# Altium schematic sheet PL_IO.SchDoc
size A3
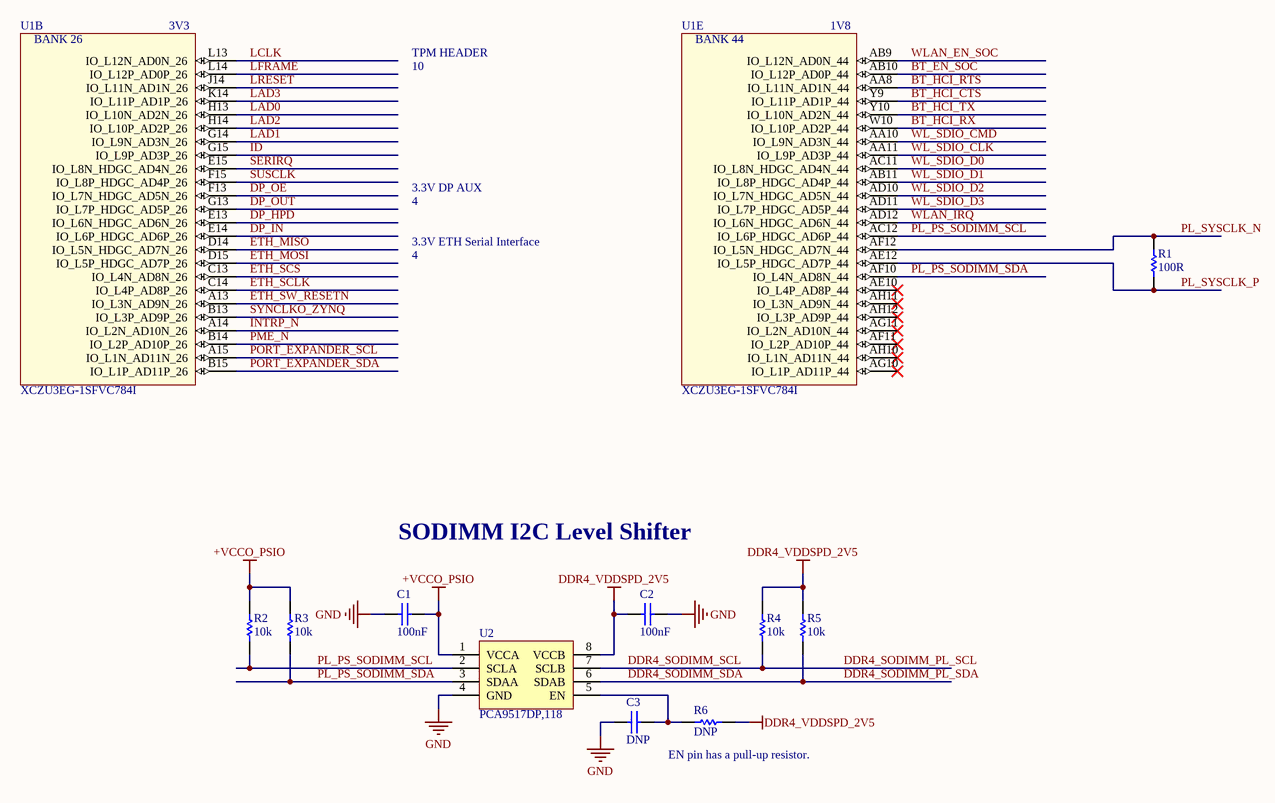
[diagram p0: PL_IO.SchDoc]

## Parts
C1  100nF  [CAPC1005L_0402]
C2  100nF  [CAPC1005L_0402]
C3  DNP  [CAPC1005L_0402]
R1  value 100R  [RESC1005L_0402]  (hidden comment: RES0402_100R_0W1_1T)
R2  value 10k  [RESC1005L_0402]  (hidden comment: RES0402_10K_0W1_05T)
R3  value 10k  [RESC1005L_0402]  (hidden comment: RES0402_10K_0W1_05T)
R4  value 10k  [RESC1005L_0402]  (hidden comment: RES0402_10K_0W1_05T)
R5  value 10k  [RESC1005L_0402]  (hidden comment: RES0402_10K_0W1_05T)
R6  value DNP  [RESC1005L_0402]  (hidden comment: RES0402)
U1  XCZU3EG-1SFVC784I  [BGA784x28]  (parts B,E of 22)
U2  PCA9517DP,118  [MSOP8_PCA9517DP,118]

## Nets
+VCCO_PSIO: C1.2 R2.2 R3.2 U2.1(VCCA)
DDR4_VDDSPD_2V5: C2.1 R4.2 R5.2 R6.2 U2.8(VCCB)
GND: C1.1 C2.2 C3.1 U2.4(GND)
BT_EN_SOC: U1.AB10(IO_L12P_AD0P_44)
BT_HCI_CTS: U1.Y9(IO_L11P_AD1P_44)
BT_HCI_RTS: U1.AA8(IO_L11N_AD1N_44)
BT_HCI_RX: U1.W10(IO_L10P_AD2P_44)
BT_HCI_TX: U1.Y10(IO_L10N_AD2N_44)
DDR4_SODIMM_PL_SCL: R4.1 U2.7(SCLB)  [also labelled DDR4_SODIMM_SCL]
DDR4_SODIMM_PL_SDA: R5.1 U2.6(SDAB)  [also labelled DDR4_SODIMM_SDA]
DP_HPD: U1.E13(IO_L6N_HDGC_AD6N_26)
DP_IN: U1.E14(IO_L6P_HDGC_AD6P_26)
DP_OE: U1.F13(IO_L7N_HDGC_AD5N_26)
DP_OUT: U1.G13(IO_L7P_HDGC_AD5P_26)
ETH_MISO: U1.D14(IO_L5N_HDGC_AD7N_26)
ETH_MOSI: U1.D15(IO_L5P_HDGC_AD7P_26)
ETH_SCLK: U1.C14(IO_L4P_AD8P_26)
ETH_SCS: U1.C13(IO_L4N_AD8N_26)
ETH_SW_RESETN: U1.A13(IO_L3N_AD9N_26)
ID: U1.G15(IO_L9P_AD3P_26)
INTRP_N: U1.A14(IO_L2N_AD10N_26)
LAD0: U1.H13(IO_L10N_AD2N_26)
LAD1: U1.G14(IO_L9N_AD3N_26)
LAD2: U1.H14(IO_L10P_AD2P_26)
LAD3: U1.K14(IO_L11P_AD1P_26)
LCLK: U1.L13(IO_L12N_AD0N_26)
LFRAME: U1.L14(IO_L12P_AD0P_26)
LRESET: U1.J14(IO_L11N_AD1N_26)
PL_PS_SODIMM_SCL: R2.1 U1.AC12(IO_L6P_HDGC_AD6P_44) U2.2(SCLA)
PL_PS_SODIMM_SDA: R3.1 U1.AF10(IO_L4N_AD8N_44) U2.3(SDAA)
PL_SYSCLK_N: R1.2 U1.AF12(IO_L5N_HDGC_AD7N_44)
PL_SYSCLK_P: R1.1 U1.AE12(IO_L5P_HDGC_AD7P_44)
PME_N: U1.B14(IO_L2P_AD10P_26)
PORT_EXPANDER_SCL: U1.A15(IO_L1N_AD11N_26)
PORT_EXPANDER_SDA: U1.B15(IO_L1P_AD11P_26)
SERIRQ: U1.E15(IO_L8N_HDGC_AD4N_26)
SUSCLK: U1.F15(IO_L8P_HDGC_AD4P_26)
SYNCLKO_ZYNQ: U1.B13(IO_L3P_AD9P_26)
WL_SDIO_CLK: U1.AA11(IO_L9P_AD3P_44)
WL_SDIO_CMD: U1.AA10(IO_L9N_AD3N_44)
WL_SDIO_D0: U1.AC11(IO_L8N_HDGC_AD4N_44)
WL_SDIO_D1: U1.AB11(IO_L8P_HDGC_AD4P_44)
WL_SDIO_D2: U1.AD10(IO_L7N_HDGC_AD5N_44)
WL_SDIO_D3: U1.AD11(IO_L7P_HDGC_AD5P_44)
WLAN_EN_SOC: U1.AB9(IO_L12N_AD0N_44)
WLAN_IRQ: U1.AD12(IO_L6N_HDGC_AD6N_44)
NetC3_2: C3.2 R6.1 U2.5(EN)

Not connected (* = marked no-connect by the designer): U1 AE10(IO_L4P_AD8P_44)* AF11(IO_L2P_AD10P_44)* AG10(IO_L1P_AD11P_44)* AG11(IO_L2N_AD10N_44)* AH10(IO_L1N_AD11N_44)* AH11(IO_L3N_AD9N_44)* AH12(IO_L3P_AD9P_44)*

## Notes on the sheet
- (near U1) 3V3
- (near U1) 1V8
- TPM HEADER
- 10
- 3.3V DP AUX
- 4
- 3.3V ETH Serial Interface
- SODIMM I2C Level Shifter
- EN pin has a pull-up resistor.
- (in symbol XCZU3EG-1SFVC784I, part B) BANK 26
- (in symbol XCZU3EG-1SFVC784I, part E) BANK 44

## Library data of the parts
C1 C2 = CAPCER0402X7R100N25V_10T: CAP CER 0.1UF 25V X7R 0402; Manufacturer 1: Murata Electronics North America; Manufacturer Part Number 1: GRM155R71E104KE14D; Tolerance: 10%; Package: 0402; ComponentLink1Description: Datasheet; Value: 100nF; Voltage: 25V; Temperature Coefficient: X7R; Supplier 1: Digi-Key; Supplier Part Number 1: 490-10698-1-ND; Operating Temperature: -55°C ~ 125°C
C3 = CAPCER0402: 0402 Package Cap Footprint; Package: 0402; ComponentLink1Description: Datasheet; Value: DNP
R1 = RES0402_100R_0W1_1T: RES SMD 100 OHM 1% 1/10W 0402; Manufacturer 1: Panasonic Electronic Components; Manufacturer Part Number 1: ERJ-2RKF1000X; Package: 0402; ComponentLink1Description: Datasheet; Power: 1/10W; Tolerance: 1%; Supplier 1: Digi-Key; Supplier Part Number 1: P100LCT-ND
R2-R5 = RES0402_10K_0W1_05T: RES SMD 10K OHM 0.5% 1/16W 0402; Manufacturer 1: Panasonic Electronic Components; Manufacturer Part Number 1: ERJ-2RHD1002X; Package: 0402; ComponentLink1Description: Datasheet; Power: 1/16W; Tolerance: 0.5%; Supplier 1: Digi-Key; Supplier Part Number 1: P15984CT-ND
R6 = RES0402: RES SMD 0402 Footprint; Package: 0402; ComponentLink1Description: Datasheet; Tolerance: -
U1 = XCZU3EG-1SFVC784I: IC FPGA 252 I/O 784FCBGA - XILINX ZYNQ ULTRASCALE+; Manufacturer 1: Xilinx Inc.; Package: SFVC784; ComponentLink1Description: Datasheet; Supplier 1: Digi-Key; Supplier Part Number 1: XCZU3EG-1SFVC784I-ND; Manufacturer Part Number 1: XCZU3EG-1SFVC784I
U2 = PCA9517DP,118: IC REDRIVER I2C 1CH 8TSSOP; Manufacturer 1: NXP USA Inc.; ComponentLink1Description: Datasheet; ComponentLink1URL: C:\Users\Public\Documents\Altium\AD16\Library\PDF\PCA9517.pdf; Supplier 1: Digi-Key; Supplier Part Number 1: 568-1829-1-ND; Manufacturer Part Number 1: PCA9517DP,118; Operating Temperature: -40°C ~ 85°C